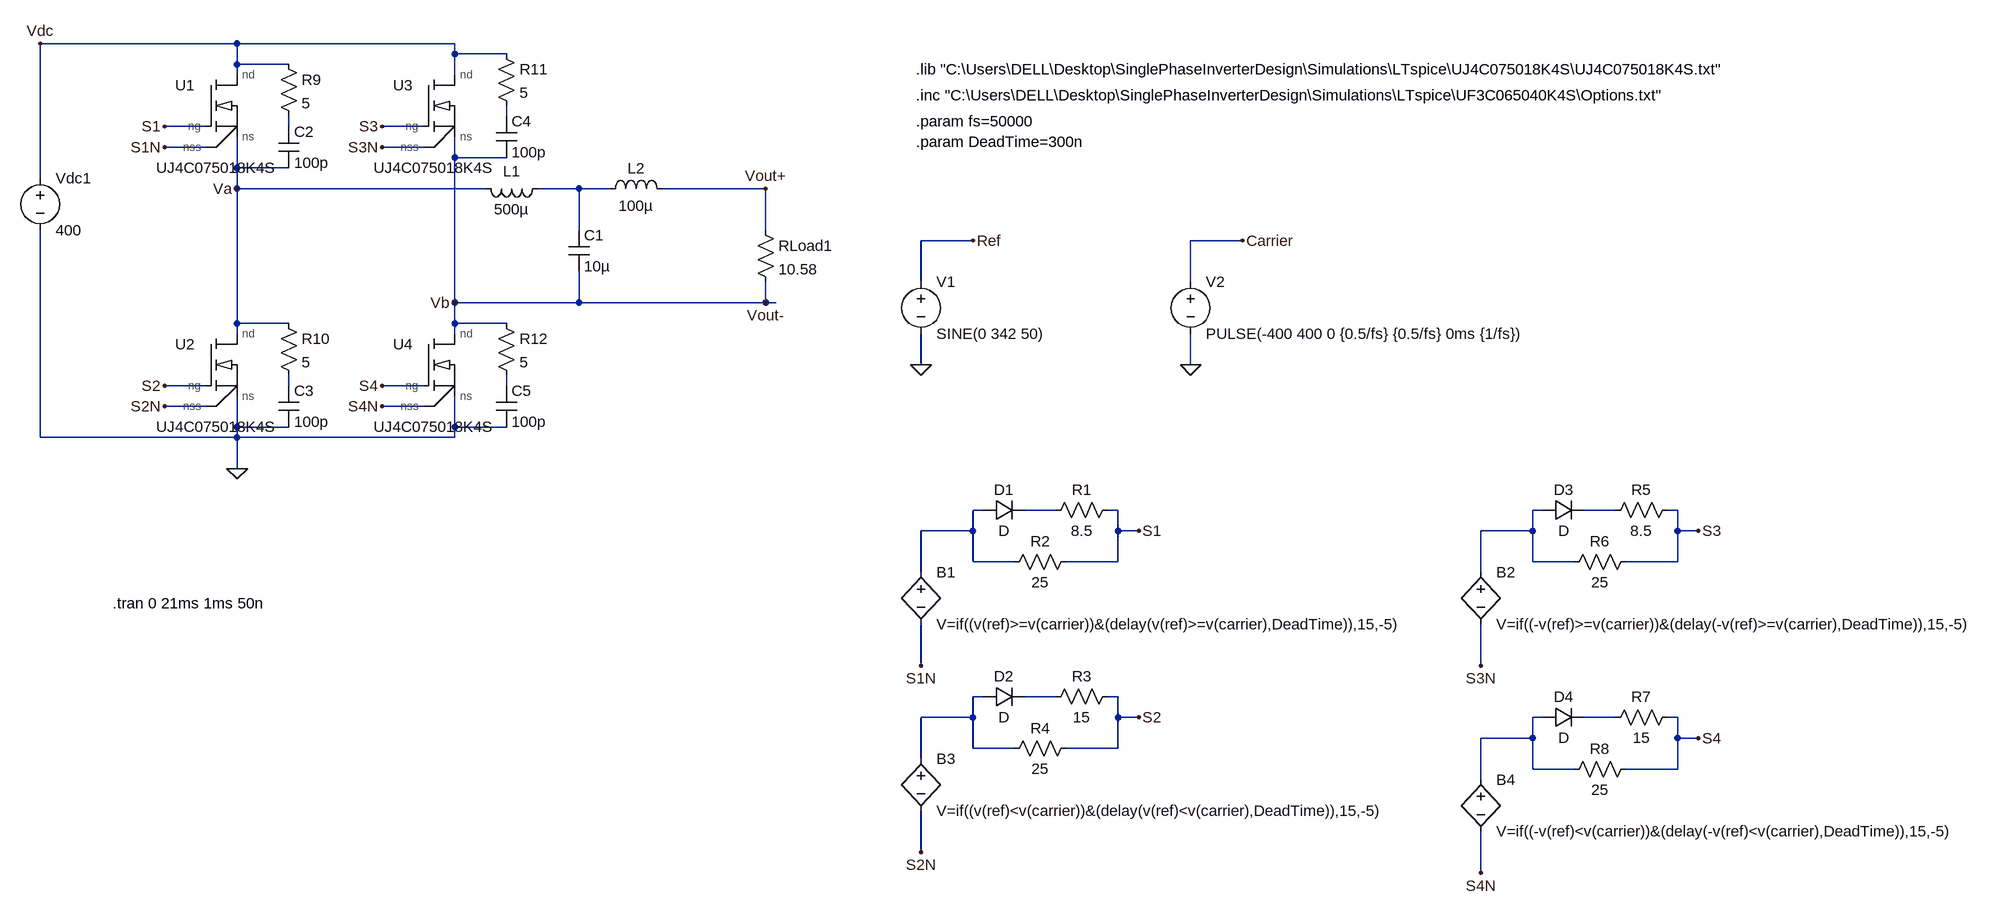
[diagram p0: schematic Unipolar_UJ4C075018K4S_DeadTime.asc]
Unipolar_UJ4C075018K4S_DeadTime.asc, the LTspice schematic file:
Version 4
SHEET 1 2316 864
WIRE -480 -528 -784 -528
WIRE -144 -528 -480 -528
WIRE -144 -512 -144 -528
WIRE -64 -512 -144 -512
WIRE -480 -496 -480 -528
WIRE -400 -496 -480 -496
WIRE -480 -480 -480 -496
WIRE -144 -480 -144 -512
WIRE -64 -416 -64 -432
WIRE -528 -400 -592 -400
WIRE -400 -400 -400 -416
WIRE -192 -400 -256 -400
WIRE -528 -368 -592 -368
WIRE -192 -368 -256 -368
WIRE -144 -352 -144 -384
WIRE -64 -352 -144 -352
WIRE -480 -336 -480 -384
WIRE -400 -336 -480 -336
WIRE -784 -320 -784 -528
WIRE -480 -304 -480 -336
WIRE -96 -304 -480 -304
WIRE 48 -304 -16 -304
WIRE 96 -304 48 -304
WIRE 336 -304 176 -304
WIRE 48 -240 48 -304
WIRE 336 -240 336 -304
WIRE 656 -224 576 -224
WIRE 1072 -224 992 -224
WIRE 576 -160 576 -224
WIRE 992 -160 992 -224
WIRE -144 -128 -144 -352
WIRE 48 -128 48 -176
WIRE 48 -128 -144 -128
WIRE 336 -128 336 -160
WIRE 336 -128 48 -128
WIRE 352 -128 336 -128
WIRE -480 -96 -480 -304
WIRE -400 -96 -480 -96
WIRE -144 -96 -144 -128
WIRE -64 -96 -144 -96
WIRE -480 -80 -480 -96
WIRE -144 -80 -144 -96
WIRE 576 -32 576 -80
WIRE 992 -32 992 -80
WIRE -528 0 -592 0
WIRE -400 0 -400 -16
WIRE -192 0 -256 0
WIRE -64 0 -64 -16
WIRE -528 32 -592 32
WIRE -192 32 -256 32
WIRE -480 64 -480 16
WIRE -400 64 -480 64
WIRE -144 64 -144 16
WIRE -64 64 -144 64
WIRE -784 80 -784 -240
WIRE -480 80 -480 64
WIRE -480 80 -784 80
WIRE -144 80 -144 64
WIRE -144 80 -480 80
WIRE -480 128 -480 80
WIRE 672 192 656 192
WIRE 784 192 736 192
WIRE 880 192 864 192
WIRE 1536 192 1520 192
WIRE 1648 192 1600 192
WIRE 1744 192 1728 192
WIRE 656 224 656 192
WIRE 656 224 576 224
WIRE 880 224 880 192
WIRE 912 224 880 224
WIRE 1520 224 1520 192
WIRE 1520 224 1440 224
WIRE 1744 224 1744 192
WIRE 1776 224 1744 224
WIRE 656 272 656 224
WIRE 720 272 656 272
WIRE 880 272 880 224
WIRE 880 272 800 272
WIRE 1520 272 1520 224
WIRE 1584 272 1520 272
WIRE 1744 272 1744 224
WIRE 1744 272 1664 272
WIRE 576 288 576 224
WIRE 1440 288 1440 224
WIRE 576 432 576 368
WIRE 1440 432 1440 368
WIRE 672 480 656 480
WIRE 784 480 736 480
WIRE 880 480 864 480
WIRE 656 512 656 480
WIRE 656 512 576 512
WIRE 880 512 880 480
WIRE 912 512 880 512
WIRE 1536 512 1520 512
WIRE 1648 512 1600 512
WIRE 1744 512 1728 512
WIRE 1520 544 1520 512
WIRE 1520 544 1440 544
WIRE 1744 544 1744 512
WIRE 1776 544 1744 544
WIRE 656 560 656 512
WIRE 720 560 656 560
WIRE 880 560 880 512
WIRE 880 560 800 560
WIRE 576 576 576 512
WIRE 1520 592 1520 544
WIRE 1584 592 1520 592
WIRE 1744 592 1744 544
WIRE 1744 592 1664 592
WIRE 1440 608 1440 544
WIRE 576 720 576 656
WIRE 1440 752 1440 688
FLAG 576 -32 0
FLAG 656 -224 Ref
FLAG 992 -32 0
FLAG 1072 -224 Carrier
FLAG 912 224 S1
FLAG 912 512 S2
FLAG 1776 224 S3
FLAG 1776 544 S4
FLAG 576 432 S1N
FLAG 576 720 S2N
FLAG 1440 432 S3N
FLAG 1440 752 S4N
FLAG -480 128 0
FLAG -592 -400 S1
FLAG -592 0 S2
FLAG -592 -368 S1N
FLAG -592 32 S2N
FLAG -256 -400 S3
FLAG -256 -368 S3N
FLAG -256 0 S4
FLAG -256 32 S4N
FLAG -784 -528 Vdc
FLAG -480 -304 Va
FLAG -144 -128 Vb
FLAG 336 -304 Vout+
FLAG 336 -128 Vout-
SYMBOL voltage 576 -176 R0
WINDOW 123 0 0 Left 0
WINDOW 39 0 0 Left 0
SYMATTR InstName V1
SYMATTR Value SINE(0 342 50)
SYMBOL voltage 992 -176 R0
WINDOW 123 0 0 Left 0
WINDOW 39 0 0 Left 0
SYMATTR InstName V2
SYMATTR Value PULSE(-400 400 0 {0.5/fs} {0.5/fs} 0ms {1/fs})
SYMBOL bv 576 272 R0
SYMATTR InstName B1
SYMATTR Value V=if((v(ref)>=v(carrier))&(delay(v(ref)>=v(carrier),DeadTime)),15,-5)
SYMBOL bv 1440 272 R0
SYMATTR InstName B2
SYMATTR Value V=if((-v(ref)>=v(carrier))&(delay(-v(ref)>=v(carrier),DeadTime)),15,-5)
SYMBOL bv 576 560 R0
SYMATTR InstName B3
SYMATTR Value V=if((v(ref)<v(carrier))&(delay(v(ref)<v(carrier),DeadTime)),15,-5)
SYMBOL bv 1440 592 R0
SYMATTR InstName B4
SYMATTR Value V=if((-v(ref)<v(carrier))&(delay(-v(ref)<v(carrier),DeadTime)),15,-5)
SYMBOL res 880 176 R90
WINDOW 0 0 56 VBottom 2
WINDOW 3 32 56 VTop 2
SYMATTR InstName R1
SYMATTR Value 8.5
SYMBOL diode 672 208 R270
WINDOW 0 32 32 VTop 2
WINDOW 3 0 32 VBottom 2
SYMATTR InstName D1
SYMBOL res 816 256 R90
WINDOW 0 0 56 VBottom 2
WINDOW 3 32 56 VTop 2
SYMATTR InstName R2
SYMATTR Value 25
SYMBOL res 880 464 R90
WINDOW 0 0 56 VBottom 2
WINDOW 3 32 56 VTop 2
SYMATTR InstName R3
SYMATTR Value 15
SYMBOL diode 672 496 R270
WINDOW 0 32 32 VTop 2
WINDOW 3 0 32 VBottom 2
SYMATTR InstName D2
SYMBOL res 816 544 R90
WINDOW 0 0 56 VBottom 2
WINDOW 3 32 56 VTop 2
SYMATTR InstName R4
SYMATTR Value 25
SYMBOL res 1744 176 R90
WINDOW 0 0 56 VBottom 2
WINDOW 3 32 56 VTop 2
SYMATTR InstName R5
SYMATTR Value 8.5
SYMBOL diode 1536 208 R270
WINDOW 0 32 32 VTop 2
WINDOW 3 0 32 VBottom 2
SYMATTR InstName D3
SYMBOL res 1680 256 R90
WINDOW 0 0 56 VBottom 2
WINDOW 3 32 56 VTop 2
SYMATTR InstName R6
SYMATTR Value 25
SYMBOL res 1744 496 R90
WINDOW 0 0 56 VBottom 2
WINDOW 3 32 56 VTop 2
SYMATTR InstName R7
SYMATTR Value 15
SYMBOL diode 1536 528 R270
WINDOW 0 32 32 VTop 2
WINDOW 3 0 32 VBottom 2
SYMATTR InstName D4
SYMBOL res 1680 576 R90
WINDOW 0 0 56 VBottom 2
WINDOW 3 32 56 VTop 2
SYMATTR InstName R8
SYMATTR Value 25
SYMBOL UF3C065040K4S -512 -432 R0
SYMATTR InstName U1
SYMATTR Value UJ4C075018K4S
SYMBOL UF3C065040K4S -512 -32 R0
SYMATTR InstName U2
SYMATTR Value UJ4C075018K4S
SYMBOL UF3C065040K4S -176 -432 R0
SYMATTR InstName U3
SYMATTR Value UJ4C075018K4S
SYMBOL UF3C065040K4S -176 -32 R0
SYMATTR InstName U4
SYMATTR Value UJ4C075018K4S
SYMBOL ind 0 -320 R90
WINDOW 0 5 56 VBottom 2
WINDOW 3 32 56 VTop 2
SYMATTR InstName L1
SYMATTR Value 500µ
SYMATTR SpiceLine Rser=30m
SYMBOL res 320 -256 R0
SYMATTR InstName RLoad1
SYMATTR Value 10.58
SYMBOL cap 32 -240 R0
SYMATTR InstName C1
SYMATTR Value 10µ
SYMATTR SpiceLine Rser=0.1m
SYMBOL ind 80 -288 R270
WINDOW 0 32 56 VTop 2
WINDOW 3 5 56 VBottom 2
SYMATTR InstName L2
SYMATTR Value 100µ
SYMBOL res -416 -512 R0
SYMATTR InstName R9
SYMATTR Value 5
SYMBOL cap -416 -400 R0
SYMATTR InstName C2
SYMATTR Value 100p
SYMBOL res -416 -112 R0
SYMATTR InstName R10
SYMATTR Value 5
SYMBOL cap -416 0 R0
SYMATTR InstName C3
SYMATTR Value 100p
SYMBOL res -80 -528 R0
SYMATTR InstName R11
SYMATTR Value 5
SYMBOL cap -80 -416 R0
SYMATTR InstName C4
SYMATTR Value 100p
SYMBOL res -80 -112 R0
SYMATTR InstName R12
SYMATTR Value 5
SYMBOL cap -80 0 R0
SYMATTR InstName C5
SYMATTR Value 100p
SYMBOL voltage -784 -336 R0
WINDOW 123 0 0 Left 0
WINDOW 39 0 0 Left 0
SYMATTR InstName Vdc1
SYMATTR Value 400
TEXT -672 336 Left 2 !.tran 0 21ms 1ms 50n
TEXT 568 -408 Left 2 !.param fs=50000\n.param DeadTime=300n
TEXT 568 -448 Left 2 !.inc "C:\\Users\\DELL\\Desktop\\SinglePhaseInverterDesign\\Simulations\\LTspice\\UF3C065040K4S\\Options.txt"
TEXT 568 -488 Left 2 !.lib "C:\\Users\\DELL\\Desktop\\SinglePhaseInverterDesign\\Simulations\\LTspice\\UJ4C075018K4S\\UJ4C075018K4S.txt"

The netlist it stands for:
* Unipolar_UJ4C075018K4S_DeadTime.asc
V1 Ref 0 SINE(0 342 50)
V2 Carrier 0 PULSE(-400 400 0 {0.5/fs} {0.5/fs} 0ms {1/fs})
B1 N006 S1N V=if((v(ref)>=v(carrier))&(delay(v(ref)>=v(carrier),DeadTime)),15,-5)
B2 N008 S3N V=if((-v(ref)>=v(carrier))&(delay(-v(ref)>=v(carrier),DeadTime)),15,-5)
B3 N010 S2N V=if((v(ref)<v(carrier))&(delay(v(ref)<v(carrier),DeadTime)),15,-5)
B4 N012 S4N V=if((-v(ref)<v(carrier))&(delay(-v(ref)<v(carrier),DeadTime)),15,-5)
R1 S1 N007 8.5
D1 N006 N007 D
R2 S1 N006 25
R3 S2 N011 15
D2 N010 N011 D
R4 S2 N010 25
R5 S3 N009 8.5
D3 N008 N009 D
R6 S3 N008 25
R7 S4 N013 15
D4 N012 N013 D
R8 S4 N012 25
XU1 Vdc S1 Va S1N UJ4C075018K4S  ; pins nd ng ns nss
XU2 Va S2 0 S2N UJ4C075018K4S  ; pins nd ng ns nss
XU3 Vdc S3 Vout- S3N UJ4C075018K4S  ; pins nd ng ns nss
XU4 Vout- S4 0 S4N UJ4C075018K4S  ; pins nd ng ns nss
L1 N003 Va 500µ Rser=30m
RLoad1 Vout+ Vout- 10.58
C1 N003 Vout- 10µ Rser=0.1m
L2 N003 Vout+ 100µ
R9 Vdc N002 5
C2 N002 Va 100p
R10 Va N004 5
C3 N004 0 100p
R11 Vdc N001 5
C4 N001 Vout- 100p
R12 Vout- N005 5
C5 N005 0 100p
Vdc1 Vdc 0 400
.model D D
.lib standard.dio
.tran 0 21ms 1ms 50n
.param fs=50000
.param DeadTime=300n
.inc "C:\Users\DELL\Desktop\SinglePhaseInverterDesign\Simulations\LTspice\UF3C065040K4S\Options.txt"
.lib "C:\Users\DELL\Desktop\SinglePhaseInverterDesign\Simulations\LTspice\UJ4C075018K4S\UJ4C075018K4S.txt"
.lib C:\Users\ycay\Desktop\FullBridge_Modulations\Transformless_SP_Inverter\FullBridge_LTspice\UF3C065040K4S\UF3C065040K4S.txt
.backanno
.end